# Altium schematic sheet Yitran_IT900_Hutschiene_PIM7A_908_1_4_und_Adapter_1.SchDoc
size 286 x 202 mm
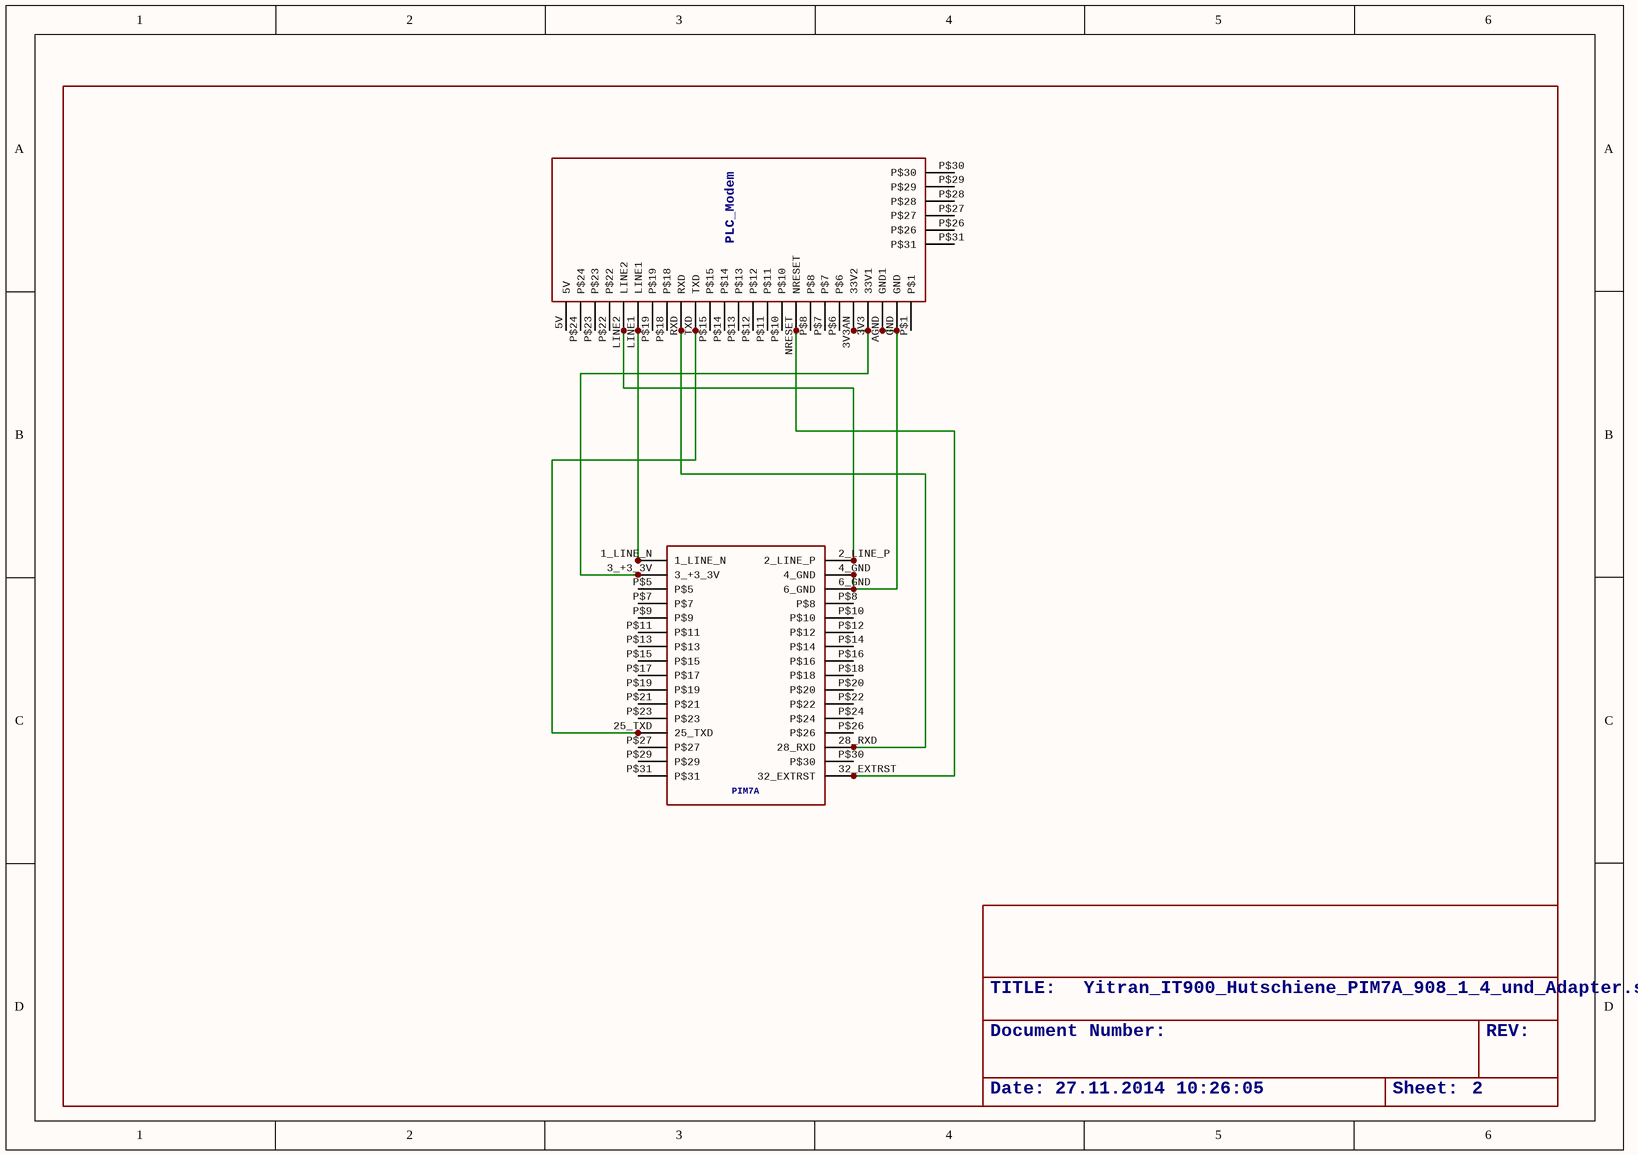
[diagram p0: Yitran_IT900_Hutschiene_PIM7A_908_1_4_und_Adapter_1.SchDoc]

## Parts
FRAME2  DINA4_L  (value not drawn)  (parts A,B of 2)
U$5  MODEMSTECKER_KLEINE_PINS  [MODEM_FUSS_KLEINE_PINS]  (value not drawn)
U$6  IT900PIM7A  [IT900PIM7A]  (value not drawn)

## Nets
NetU$5_3V3: U$5.3V3(33V1) U$5.3V3AN(33V2) U$6.3_+3_3V
NetU$5_AGND: U$5.AGND(GND1) U$5.GND U$6.4_GND U$6.6_GND
NetU$5_LINE1: U$5.LINE1 U$6.1_LINE_N
NetU$5_LINE2: U$5.LINE2 U$6.2_LINE_P
NetU$5_NRESET: U$5.NRESET U$6.32_EXTRST
NetU$5_RXD: U$5.RXD U$6.28_RXD
NetU$5_TXD: U$5.TXD U$6.25_TXD

Not connected (* = marked no-connect by the designer): U$5 5V P$1 P$6 P$7 P$8 P$10 P$11 P$12 P$13 P$14 P$15 P$18 P$19 P$22 P$23 P$24 P$26 P$27 P$28 P$29 P$30 P$31; U$6 P$5 P$7 P$8 P$9 P$10 P$11 P$12 P$13 P$14 P$15 P$16 P$17 P$18 P$19 P$20 P$21 P$22 P$23 P$24 P$26 P$27 P$29 P$30 P$31

## Library data of the parts
FRAME2 = DINA4_L: <b>FRAME</b><p> / DIN A4, landscape with extra doc field
U$5 = MODEMSTECKER_KLEINE_PINS: PLC_Modem: PLC_Modem
U$6 = IT900PIM7A: PIM7A: PIM7A